# Altium schematic sheet Control_Module_PER.SchDoc: Módulo de Control - Periféricos
size A4; Author: Martin C.A. Yunis; CompanyName: Sistema de Control de Acceso; Revision: V1; SheetNumber: 6; SheetTotal: 7
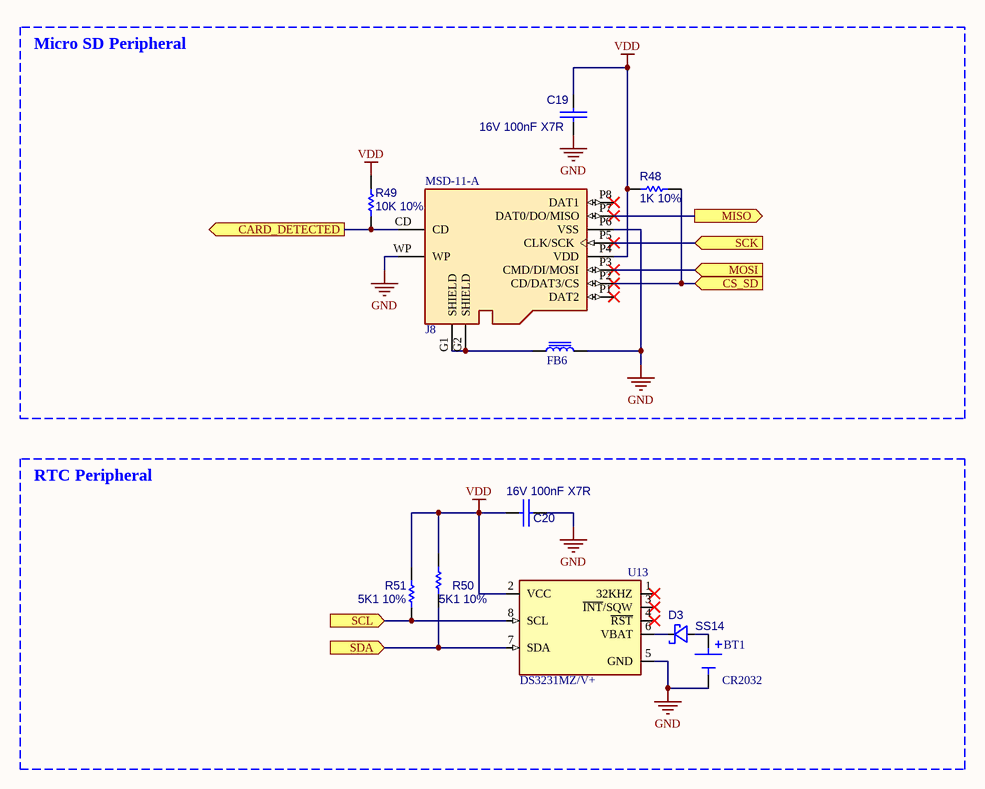
[diagram p0: Control_Module_PER.SchDoc]

## Parts
BT1  CR2032  [KEYSTONE_1063TR_1063TR]
C19  16V 100nF X7R  [CAP0402]
C20  16V 100nF X7R  [CAP0402]
D3  SS14  [D_SMA]
FB6  Choke 450mΩ ±25%  [CHOKE0603]  (value not drawn)
J8  MSD-11-A  [CUI_MSD-11-A]
R48  1K 10%  [RES0402]
R49  10K 10%  [RES0402]
R50  5K1 10%  [RES0402]
R51  5K1 10%  [RES0402]
U13  DS3231MZ/V+  [21-0041B_8]

## Blocks framed on the sheet
Micro SD Peripheral: C19 FB6 J8 R48 R49
RTC Peripheral: BT1 C20 D3 R50 R51 U13

## Ports
CARD_DETECTED (out, see Control_Module_MAIN[2C], Control_Module_CPU[2B]), CS_SD (in, see Control_Module_MAIN[2C], Control_Module_CPU[1B]), MISO (out, see Control_Module_MAIN[2B], Control_Module_CPU[1C]), MOSI (in, see Control_Module_MAIN[2C], Control_Module_CPU[1B]), SCK (in, see Control_Module_MAIN[2B], Control_Module_CPU[1C]), SCL (in, see Control_Module_MAIN[2C], Control_Module_CPU[2B]), SDA (in, see Control_Module_MAIN[2C], Control_Module_CPU[2B])

## Nets
GND: BT1.N C19.2 C20.2 FB6.2 J8.P6(VSS) J8.WP U13.5(GND)
VDD: C19.1 C20.1 J8.P4(VDD) R48.1 R49.1 R50.1 R51.1 U13.2(VCC)
CARD_DETECTED: J8.CD R49.2 ; port CARD_DETECTED
CS_SD: J8.P2(CD/DAT3/CS) R48.2 ; port CS_SD
MISO: J8.P7(DAT0/DO/MISO) ; port MISO
MOSI: J8.P3(CMD/DI/MOSI) ; port MOSI
SCK: J8.P5(CLK/SCK) ; port SCK
SCL: R51.2 U13.8(SCL) ; port SCL
SDA: R50.2 U13.7(SDA) ; port SDA
NetBT1_P: BT1.P D3.1(A)
NetD3_2: D3.2(K) U13.6(VBAT)
NetFB6_1: FB6.1 J8.G1(SHIELD) J8.G2(SHIELD)

Not connected (* = marked no-connect by the designer): J8 P1(DAT2)* P8(DAT1)*; U13 1(32KHZ)* 3(~{INT}/SQW)* 4(~{RST})*

## Notes on the sheet
- Title:
- Size:
- Author:
- A4
- Sheet
- of
- Revision:
- File:
- Date:

## Library data of the parts
BT1 = BAT-HLD-011-THM: Battery Holder Coin 20 SMT Nickel T&R; MANUF P/N: BS-06-B4BK006; MF: TE Connectivity; SnapEDA_Link: https://www.snapeda.com/parts/BAT-HLD-011-THM/TE+Connectivity/view-part/?ref=snap; Package: None; Value: *; MP: BAT-HLD-011-THM; Check_prices: https://www.snapeda.com/parts/BAT-HLD-011-THM/TE+Connectivity/view-part/?ref=eda; JLCPCB P/N: C964764
C19 C20 = CAP: Non Polarized Capacitor; MANUF P/N: CL05B104KO5NNNC; JLCPCB P/N: C1525
D3 = DIODO_SH: Diode Shottky; MANUF P/N: SS14; JLCPCB P/N: C2480
FB6 = Choke: High Frequency EMI Suppression Ferrite Bead; Manufacturer Part Number: 742863160; Manufacturer: Wurth Elektronik; MANUF P/N: GZ1608D601TF; Match Code: WE-CBF HF; Case/Size Code: 0603; DC Resistance: 0.22Ohm; Impedance @100MHz: 600Ohm; Impedance @1GHz: 800Ohm; Impedance Max: 950Ohm; Impedance Max Test Condition: 600MHz; Rated Current: 0.5A; Type: High Current; Category: Ferrites for PCB Assembly; ComponentLink1Description: Website Link; ComponentLink1URL: https://www.we-online.com/redexpert/article/742863160?ad; ComponentLink2Description: Datasheet Link; ComponentLink2URL: https://www.we-online.com/redexpert/spec/742863160?ad; Mount: Surface Mount; Operating Temperature Max: 125°C; Operating Temperature Min: -55°C; Packaging: Tape and Reel; Length: 1.6mm; Width: 0.8mm; Height: 0.8mm; JLCPCB P/N: C1002
J8 = MSD-11-A: Micro SD Card Connector, 8 Positions, Connector and Ejector, Push In, Auto Eject Out, Surface Mount, 1.85 mm Heaight Above Board, Gold Flash; MANUF P/N: SD-01A; MF: Same Sky; SnapEDA_Link: https://www.snapeda.com/parts/MSD-11-A/Same+Sky/view-part/?ref=snap; Package: None; Value: *; MP: MSD-11-A; Check_prices: https://www.snapeda.com/parts/MSD-11-A/Same+Sky/view-part/?ref=eda; JLCPCB P/N: C693845
R48 = Res1: Resistor; MANUF P/N: CRCW04021K00FKED; JLCPCB P/N: C71623
R49 = Res1: Resistor; MANUF P/N: CRCW040210K0FKED; JLCPCB P/N: C71617
R50 R51 = Res1: Resistor; MANUF P/N: CR0402JF0512G; JLCPCB P/N: C100665
U13 = DS3231MZ/V+: ±5ppm, I2C Real-Time Clock; MANUF P/N: DS3231MZ+TRL; MF: Analog Devices; SnapEDA_Link: https://www.snapeda.com/parts/DS3231MZ/V+/Analog+Devices/view-part/?ref=snap; Package: SOIC-8 Maxim; Value: *; MP: DS3231MZ/V+; Check_prices: https://www.snapeda.com/parts/DS3231MZ/V+/Analog+Devices/view-part/?ref=eda; JLCPCB P/N: C107410